# Altium schematic sheet LEDS.SchDoc
size A2; SheetNumber: 7; SheetTotal: 8
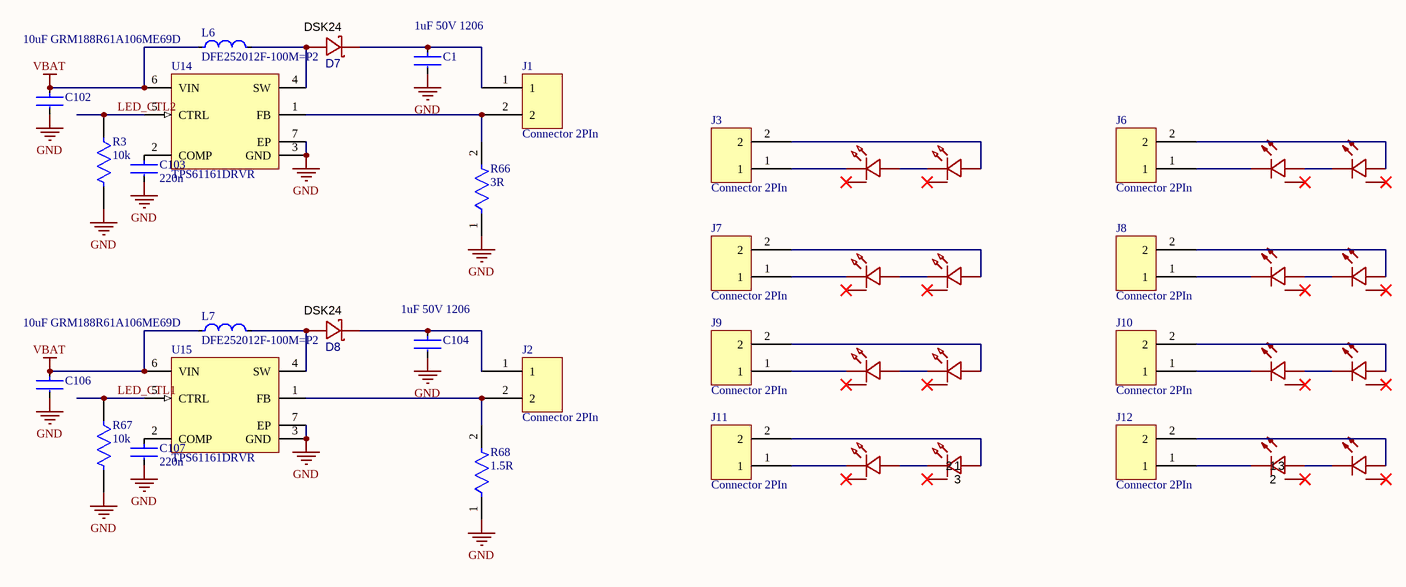
[diagram p0: LEDS.SchDoc]

## Parts
C1  1uF 50V 1206  [FP-1206-L_3_2_0_2-W_1_6_0-IPC_B]
C102  10uF GRM188R61A106ME69D  [FP-GRM188-0_15-MFG]
C103  220n  [CAP_0402]
C104  1uF 50V 1206  [FP-1206-L_3_2_0_2-W_1_6_0-IPC_B]
C106  10uF GRM188R61A106ME69D  [FP-GRM188-0_15-MFG]
C107  220n  [CAP_0402]
D7  DSK24  [DSK24]
D8  DSK24  [DSK24]
J1  Connector 2PIn  [CON_2P]
J2  Connector 2PIn  [CON_2P]
J3  Connector 2PIn  [CON_2P]
J6  Connector 2PIn  [CON_2P]
J7  Connector 2PIn  [CON_2P]
J8  Connector 2PIn  [CON_2P]
J9  Connector 2PIn  [CON_2P]
J10  Connector 2PIn  [CON_2P]
J11  Connector 2PIn  [CON_2P]
J12  Connector 2PIn  [CON_2P]
L6  DFE252012F-100M=P2  [FP-DFE252012C-IPC_B]
L7  DFE252012F-100M=P2  [FP-DFE252012C-IPC_B]
LED1  xl-hd3535uwc-a2  [XL-HD3535UWC-A2]  (value not drawn)
LED2  xl-hd3535uwc-a2  [XL-HD3535UWC-A2]  (value not drawn)
LED3  jnj-ltji0112w120/35mil/845-860nm  [JNJ-LTJI0112W120]  (value not drawn)
LED4  xl-hd3535uwc-a2  [XL-HD3535UWC-A2]  (value not drawn)
LED5  xl-hd3535uwc-a2  [XL-HD3535UWC-A2]  (value not drawn)
LED6  jnj-ltji0112w120/35mil/845-860nm  [JNJ-LTJI0112W120]  (value not drawn)
LED7  jnj-ltji0112w120/35mil/845-860nm  [JNJ-LTJI0112W120]  (value not drawn)
LED8  xl-hd3535uwc-a2  [XL-HD3535UWC-A2]  (value not drawn)
LED9  xl-hd3535uwc-a2  [XL-HD3535UWC-A2]  (value not drawn)
LED10  jnj-ltji0112w120/35mil/845-860nm  [JNJ-LTJI0112W120]  (value not drawn)
LED11  jnj-ltji0112w120/35mil/845-860nm  [JNJ-LTJI0112W120]  (value not drawn)
LED12  xl-hd3535uwc-a2  [XL-HD3535UWC-A2]  (value not drawn)
LED13  xl-hd3535uwc-a2  [XL-HD3535UWC-A2]  (value not drawn)
LED14  jnj-ltji0112w120/35mil/845-860nm  [JNJ-LTJI0112W120]  (value not drawn)
LED15  jnj-ltji0112w120/35mil/845-860nm  [JNJ-LTJI0112W120]  (value not drawn)
LED16  jnj-ltji0112w120/35mil/845-860nm  [JNJ-LTJI0112W120]  (value not drawn)
R3  10k  [RES_0402]
R66  3R  [FP-SR0603-MFG]
R67  10k  [RES_0402]
R68  1.5R  [FP-SR0603-MFG]
U14  TPS61161DRVR  [TPS61160ADRVT]
U15  TPS61161DRVR  [TPS61160ADRVT]

## Nets
GND: C1.2 C102.2 C103.2 C104.2 C106.2 C107.2 R3.2 R66.1 R67.2 R68.1 U14.3(GND) U14.7(EP) U15.3(GND) U15.7(EP)
VBAT: C102.1 C106.1 L6.1 L7.1 U14.6(VIN) U15.6(VIN)
LED_CTL1: R67.1 U15.5(CTRL)
LED_CTL2: R3.1 U14.5(CTRL)
NetC1_1: C1.1 D7.1(K) J1.1
NetC103_1: C103.1 U14.2(COMP)
NetC104_1: C104.1 D8.1(K) J2.1
NetC107_1: C107.1 U15.2(COMP)
NetD7_2: D7.2(A) L6.2 U14.4(SW)
NetD8_2: D8.2(A) L7.2 U15.4(SW)
NetJ1_2: J1.2 R66.2 U14.1(FB)
NetJ2_2: J2.2 R68.2 U15.1(FB)
NetJ3_1: J3.1 LED1.1
NetJ3_2: J3.2 LED2.2
NetJ6_1: J6.1 LED16.3
NetJ6_2: J6.2 LED3.1
NetJ7_1: J7.1 LED4.1
NetJ7_2: J7.2 LED5.2
NetJ8_1: J8.1 LED6.3
NetJ8_2: J8.2 LED7.1
NetJ9_1: J9.1 LED8.1
NetJ9_2: J9.2 LED9.2
NetJ10_1: J10.1 LED10.3
NetJ10_2: J10.2 LED11.1
NetJ11_1: J11.1 LED12.1
NetJ11_2: J11.2 LED13.2
NetJ12_1: J12.1 LED14.3
NetJ12_2: J12.2 LED15.1
NetLED1_2: LED1.2 LED2.1
NetLED3_3: LED3.3 LED16.1
NetLED4_2: LED4.2 LED5.1
NetLED6_1: LED6.1 LED7.3
NetLED8_2: LED8.2 LED9.1
NetLED10_1: LED10.1 LED11.3
NetLED12_2: LED12.2 LED13.1
NetLED14_1: LED14.1 LED15.3

Not connected (* = marked no-connect by the designer): LED1 3*; LED2 3*; LED3 2*; LED4 3*; LED5 3*; LED6 2*; LED7 2*; LED8 3*; LED9 3*; LED10 2*; LED11 2*; LED12 3*; LED13 3*; LED14 2*; LED15 2*; LED16 2*

## Library data of the parts
C1 C104 = CMP-04427-010925-1: C1848; Tolerance: 5%; Dielectric: X7R; Mount: Surface Mount; Min Operating Temperature: -55°C; Voltage Rating (DC): 50V; Ratings: AEC-Q200; RoHS Compliant: Yes; Max Operating Temperature: 125°C; Width: 0.063inch; Voltage Rating: 50V; Thickness: 0.037inch; Package Quantity: 2000; Capacitance: 1uF; Packaging: Tape and Reel; Length: 0.126inch; Case/Package: 1206; Value: 1uF
C102 C106 = CMP-06035-003612-1: C19702; Tolerance: 20%; Dielectric: X5R; Voltage Rating: 10V; Material: Ceramic; Package Quantity: 4000; Width: 0.8mm; Case/Package: 0603; Thickness: 0.035inch; Capacitance: 10uF; Voltage Rating (DC): 10V; Termination: SMD/SMT; Length: 1.6mm; Lead Free: Lead Free; Mount: Surface Mount; Height: 0.8mm; Depth: 0.8mm; Packaging: Tape and Reel; Weight: 0.000222oz; Min Operating Temperature: -55°C; Case Code (Metric): 1608; Max Operating Temperature: 85°C; Case Code (Imperial): 0603; Value: 10uF
C103 C107 = CMP-03422-001116-1: C16772; Tolerance: 10%; Voltage Rating: 50V; Capacitance: 220nF; Value: 220nF; Max Operating Temperature: 125°C; Case Code (Metric): 1005; RoHS Compliant: Yes; Series: -; Case Code (Imperial): 0402; Min Operating Temperature: -55°C; Mount: Surface Mount; Case/Package: 0402; Packaging: Cut Tape
D7 D8 = dsk24_c64890: C22466352; Manufacturer: MDD(辰达半导体); Symbol: DSK24 K24; AddInBom: yes; ModelId: 560a7cf99d0e44cb9af362aaf5d7923d; ModelName: SOD-123_L2.8-W1.8-LS3.7-RD; ModelTransform: 144.8816,62.992,0,0,0,0,0,0,0; Diode Configuration: Independent; Voltage - Forward(Vf@If): 550mV@2A; Voltage - DC Reverse(Vr): 40V; Current - Rectified: 2A; Reverse Leakage Current (Ir): 500uA@40V; Operating Junction Temperature Range: -55℃~+150℃; LCSC Part Name: 电压:40V 电流:2A; SupplierPart: C64890; ManufacturerPart: DSK24; Supplier Footprint: SOD-123FL; JLCPCB Part Class: Extended Part; Datasheet: https://item.szlcsc.com/datasheet/DSK24/65960.html; Supplier: LCSC; ConvertToPcb: yes; FootprintName: SOD-123_L2.8-W1.8-LS3.7-RD
J1-J3 J6-J12 = CON2P
L6 L7 = CMP-06042-007232-1: C703141; DC Resistance (DCR): 480mR; Current Rating: 950mA; Inductance: 10uH; Tolerance: 20%; Test Frequency: 1MHz; Shielding: Shielded; Saturation Current: 1.6A; Core Material: Ferrite; Value: 10uH; Case/Package: 1008; Length: 0.098inch; Case Code (Metric): 2520; Width: 0.079inch; Case Code (Imperial): 1008; Height - Seated (Max): 0.047inch; Packaging: Tape and Reel; Mount: Surface Mount; Min Operating Temperature: -40°C; Max Operating Temperature: 125°C
LED1 LED2 LED4 LED5 LED8 LED9 LED12 LED13 = xl-hd3535uwc-a2: C3646951; Manufacturer: XINGLIGHT(成兴光); AddInBom: yes; ModelId: 24cabb2563c34a16901b89b669d22d94; ModelName: LED-SMD_3P-L3.5-W3.5_XL-HD3535UWC-A2-3; ModelTransform: 135.827,135.86587,0,0,0,0,0,0,0; Lamp Holder Type: 3.5mm x 3.5mm square LED; Illumination Color: White; Voltage - Forward(Vf): 2.8V~3.6V; Power(Watts): 1W; Forward Current: 350mA; Diode Configuration: Discrete Diode; Lens Color: Water Clear; Color Temperature: 5500K~7000K; Viewing Angle: 130°; Symbol: XL-HD3535UWC-A2; LCSC Part Name: 3535球头白1W贴片式发光二极管; SupplierPart: C3646951; ManufacturerPart: XL-HD3535UWC-A2; Supplier Footprint: SMD3535-3P; JLCPCB Part Class: Extended Part; Datasheet: https://item.szlcsc.com/datasheet/XL-HD3535UWC-A2/4213794.html; Supplier: LCSC; ConvertToPcb: yes; FootprintName: LED-SMD_3P-L3.5-W3.5_XL-HD3535UWC-A2-3; Wavelength - Dominant: -; Peak Wavelength: -; Luminous Intensity: -; Mounting Style: Top-mount; Operating Temperature: -40℃~+85℃
LED3 LED6 LED7 LED10 LED11 LED14-LED16 = jnj-ltji0112w120/35mil/845-860nm: C19185834; Manufacturer: JNJOPTO(强生光电); AddInBom: yes; ModelId: ae706680f6654db0b87a2ee284df6a85; ModelName: LED-SMD_3P-L3.5-W3.5_JNJ-LTJID0114T140; ModelTransform: 137.795,138.1887,0,0,0,0,0,0,0; Voltage - Forward(Vf): 1.4V~2.1V；1.5V~2.3V; Wavelength: 850nm; Radiant Intensity: 75mW/sr@IF=350mA；140mW/sr@IF=1000mA; Current - DC Forward(If): 1A; Voltage - DC Reverse(Vr): 5V; Viewing Angle: 120°; Half wave width: 50nm; Symbol: JNJ-LTJI0112W120/35MIL/845-860NM; LCSC Part Name: 3535白色陶瓷晶元35mil球头120度灯源845-860nm; SupplierPart: C19185834; ManufacturerPart: JNJ-LTJI0112W120/35mil/845-860nm; Supplier Footprint: SMD3535-3P; JLCPCB Part Class: Extended Part; Datasheet: https://item.szlcsc.com/datasheet/JNJ-LTJI0112W120%252F35mil%252F845-860nm/20403639.html; Supplier: LCSC; ConvertToPcb: yes; FootprintName: LED-SMD_3P-L3.5-W3.5_JNJ-LTJID0114T140; Pd - Power Dissipation: -; Operating Temperature: -40℃~+100℃
R3 R67 = CMP-03412-016018-1: C25744; Tolerance: 1%; Temperature Coefficient: 100ppm/°C; Resistance: 10kOhm; Max Power Dissipation: 63mW; Value: 10kOhm; Ratings: AEC-Q200; Resistor Type: Thick Film; Number of Terminations: 2; RoHS Compliant: Yes; Min Operating Temperature: -55°C; Case/Package: 0402; Series: AC; Length: 0.039inch; Width: 0.02inch; Features: Moisture Resistant; Height: 0.015inch; Packaging: Tape and Reel; Max Operating Temperature: 155°C
R66 = CMP-03412-016018-1: C23157; Manufacturer Part Number: SR0603FR-7T10RL; Manufacturer: Yageo; Voltage Rating: 75V; Value: 3Ohm; Tolerance: 0.01; Automotive Grade: Grade 0; Power Rating: 0.25W; Footprint Url: http://www.yageo.com/exep/pages/download/literatures/PYu-R_Mount_10.pdf; Digikey Description: RES SMD 0603 1/10W 1% 3 OHM; Device Class L2: Resistors; Octopart: https://octopart.com/sr0603fr-7t10rl-yageo-91478074; Temperature Range Low: -55°C; Device Class L3: Chip SMD Resistors; ComponentLink2Description: Datasheet; Height: 0.55mm; Automotive: Yes; Lead Free: Yes; Category: Res; Resistance: 3Ohm; RoHS: TRUE; Series: SR; Temperature: -55°C to +155°C; Device Class L1: Passive Components; Temperature Range High: +155°C; Composition: Thick Film; Package: SR0603; ComponentLink2URL: http://www.yageo.com/documents/recent/PYu-SR_D_F%20tol_RoHS_L_3.pdf; Ipc Land Pattern Name: RESC16080X45
R68 = CMP-03412-016018-1: C22769; Manufacturer Part Number: SR0603FR-7T10RL; Manufacturer: Yageo; Voltage Rating: 75V; Value: 1.5Ohm; Tolerance: 0.01; Automotive Grade: Grade 0; Power Rating: 0.25W; Footprint Url: http://www.yageo.com/exep/pages/download/literatures/PYu-R_Mount_10.pdf; Digikey Description: RES SMD 0603 1/10W 1% 1.5 OHM; Device Class L2: Resistors; Octopart: https://octopart.com/sr0603fr-7t10rl-yageo-91478074; Temperature Range Low: -55°C; Device Class L3: Chip SMD Resistors; ComponentLink2Description: Datasheet; Height: 0.55mm; Automotive: Yes; Lead Free: Yes; Category: Res; Resistance: 1.5Ohm; RoHS: TRUE; Series: SR; Temperature: -55°C to +155°C; Device Class L1: Passive Components; Temperature Range High: +155°C; Composition: Thick Film; Package: SR0603; ComponentLink2URL: http://www.yageo.com/documents/recent/PYu-SR_D_F%20tol_RoHS_L_3.pdf; Ipc Land Pattern Name: RESC16080X45
U14 U15 = TI-TPS6116XDRV6-1600X1000TP: C324075; Manufacturer: Texas Instruments; Dimming: TRUE; Vin(Max)(V): 18; Vin(Min)(V): 2.7; SubFamily: White LED Driver; Iq(Typ)(mA): 1.5; Switching Frequency(Max)(kHz): 600; Topology: Boost; Rating: Catalog; Eco-Plan: Green (RoHS & no Sb/Br); ComponentLink2Description: Datasheet; Mounting Technology: Surface Mount; DatasheetVersion: SLVS937A; PackageReference: DRV0006A; PartNumber: TPS61161DRVR; ComponentLink2URL: http://www.ti.com/general/docs/lit/getliterature.tsp?genericPartNumber=TPS61160A&fileType=pdf; ComponentLink1URL: http://www.ti.com/; ComponentLink3Description: Package Specification; Synchronous Rectification: TRUE; PackageDescription: 6-Pin Plastic Small Outline No-Lead, Body 2 x 2 mm, Pitch 0.65 mm; ComponentLink3URL: http://www.ti.com/litv/pdf/mpds216d; ComponentLink1Description: Manufacturer URL; PackageVersion: 4206925/E